# EAGLE design PSPS_AVNC_SRD_central-2020-09-19 (EAGLE 9.6.2)
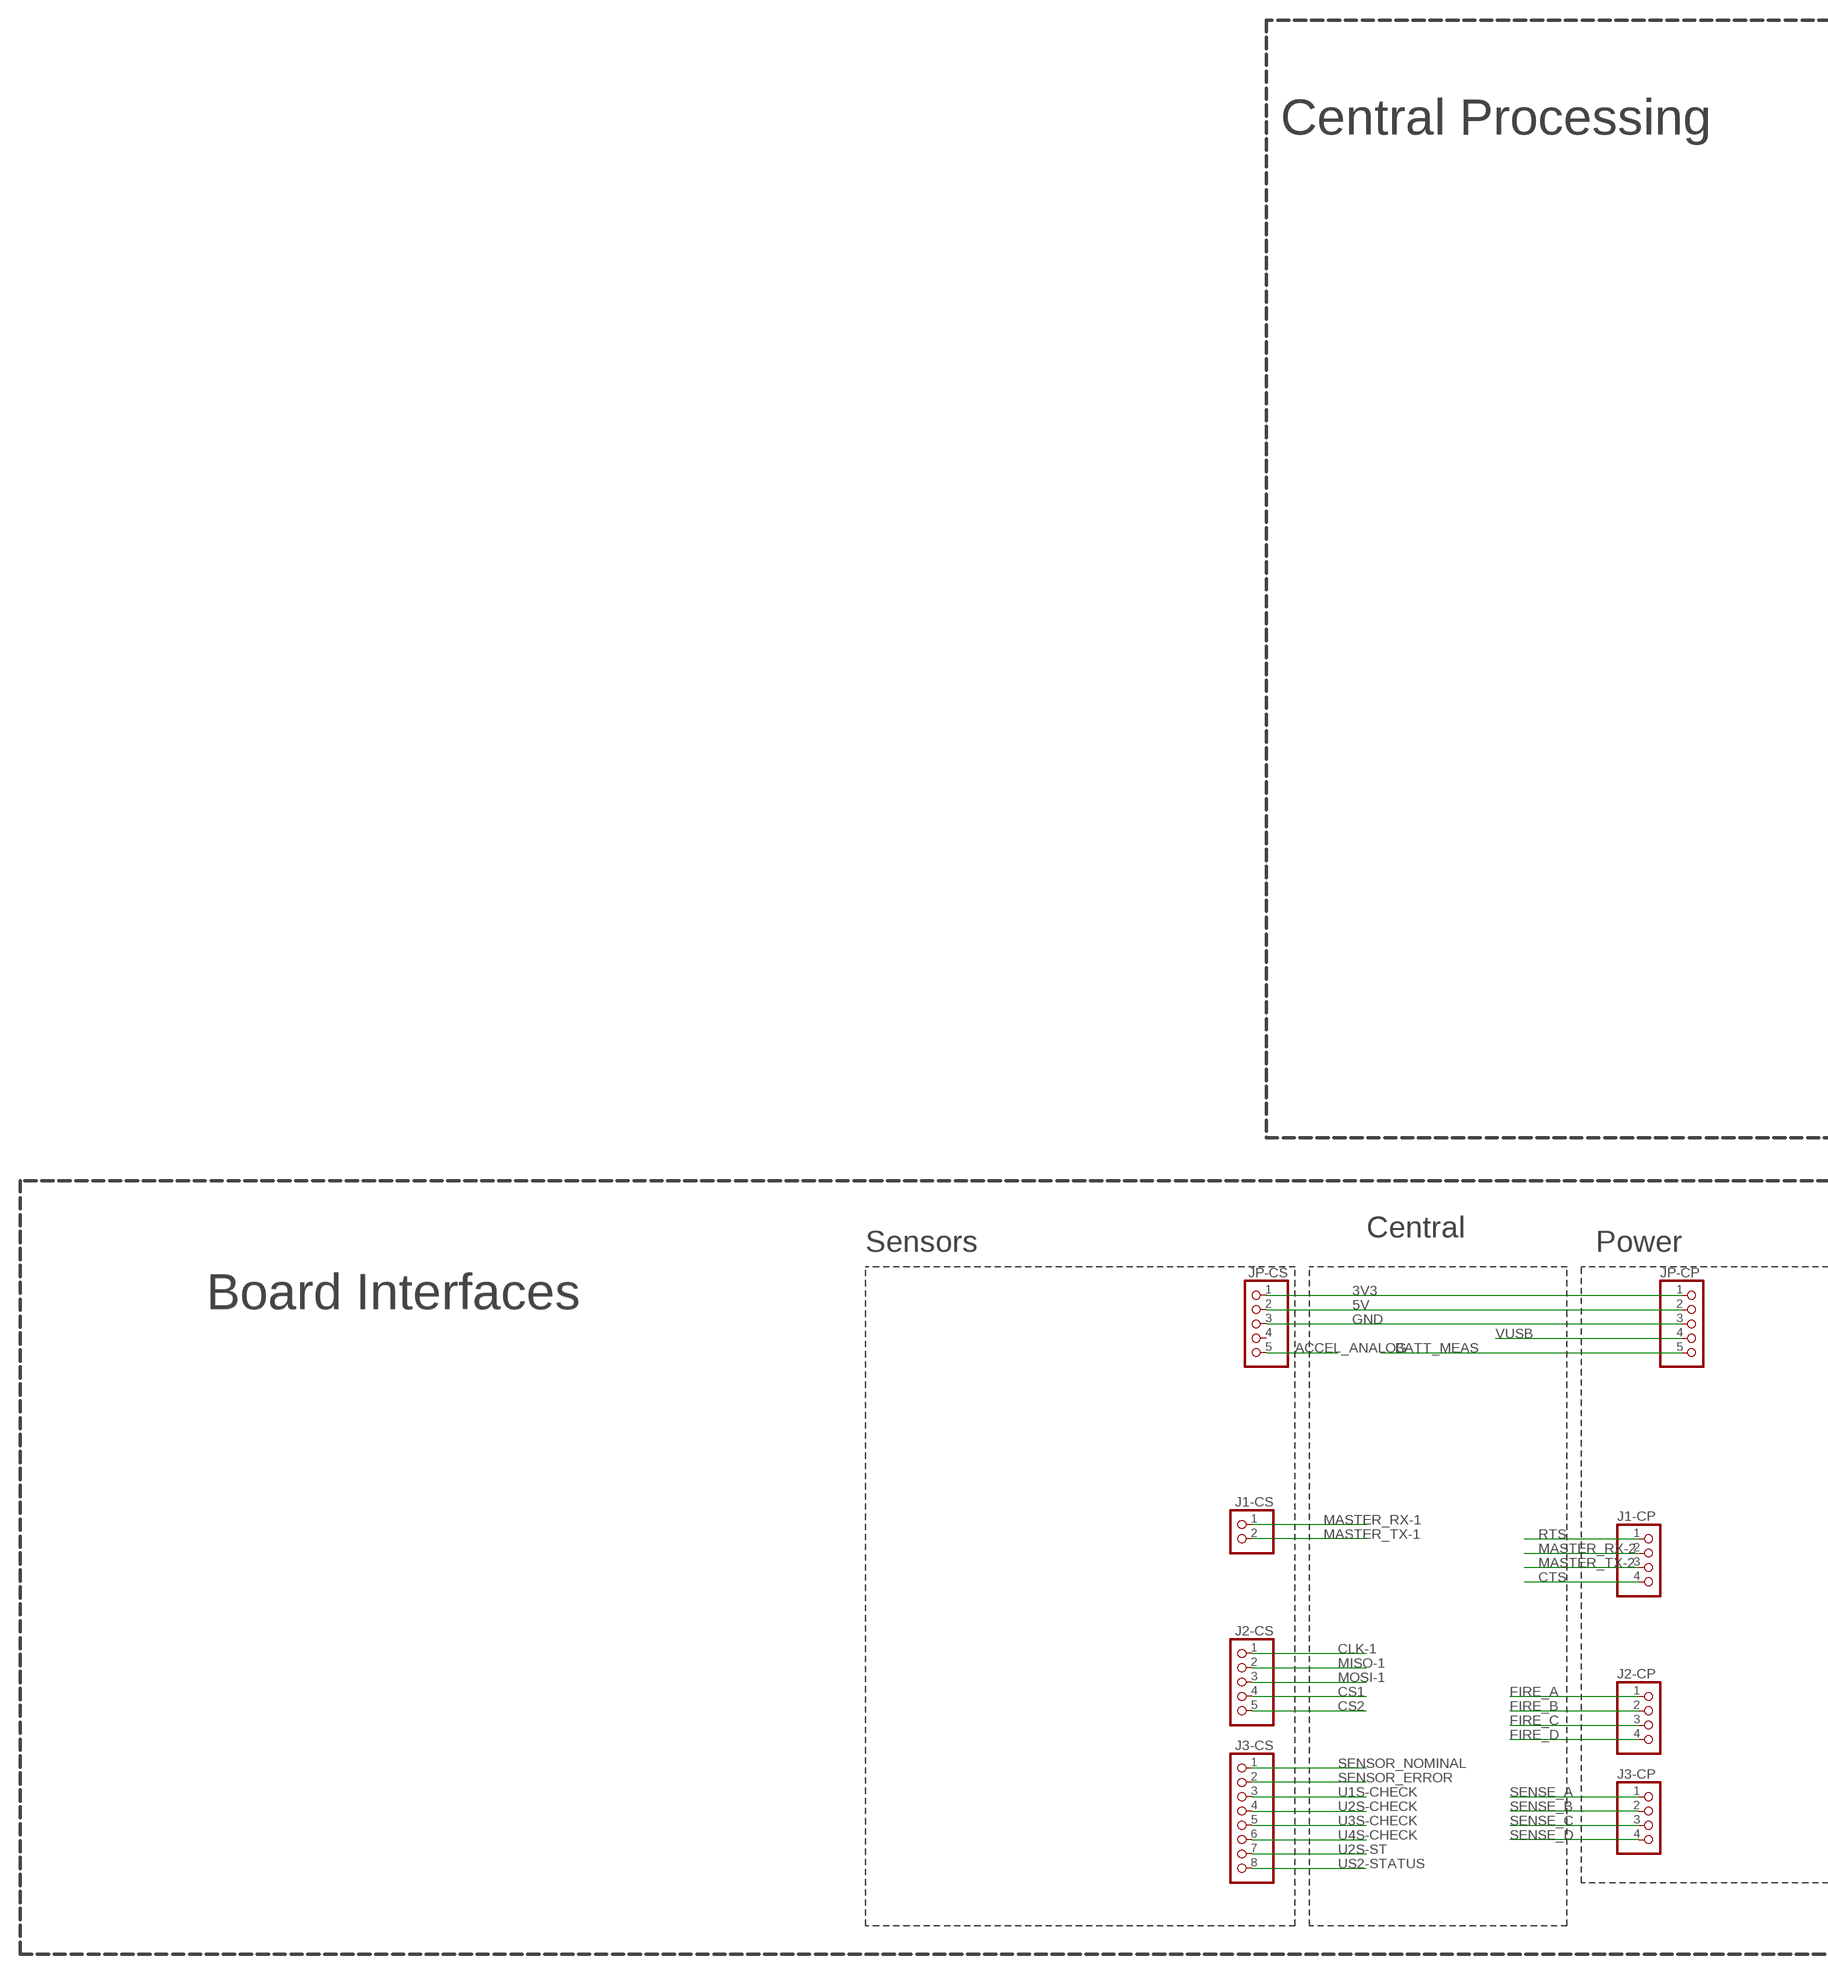
[diagram p0: schematic, sheet 1, part 1 of 2]
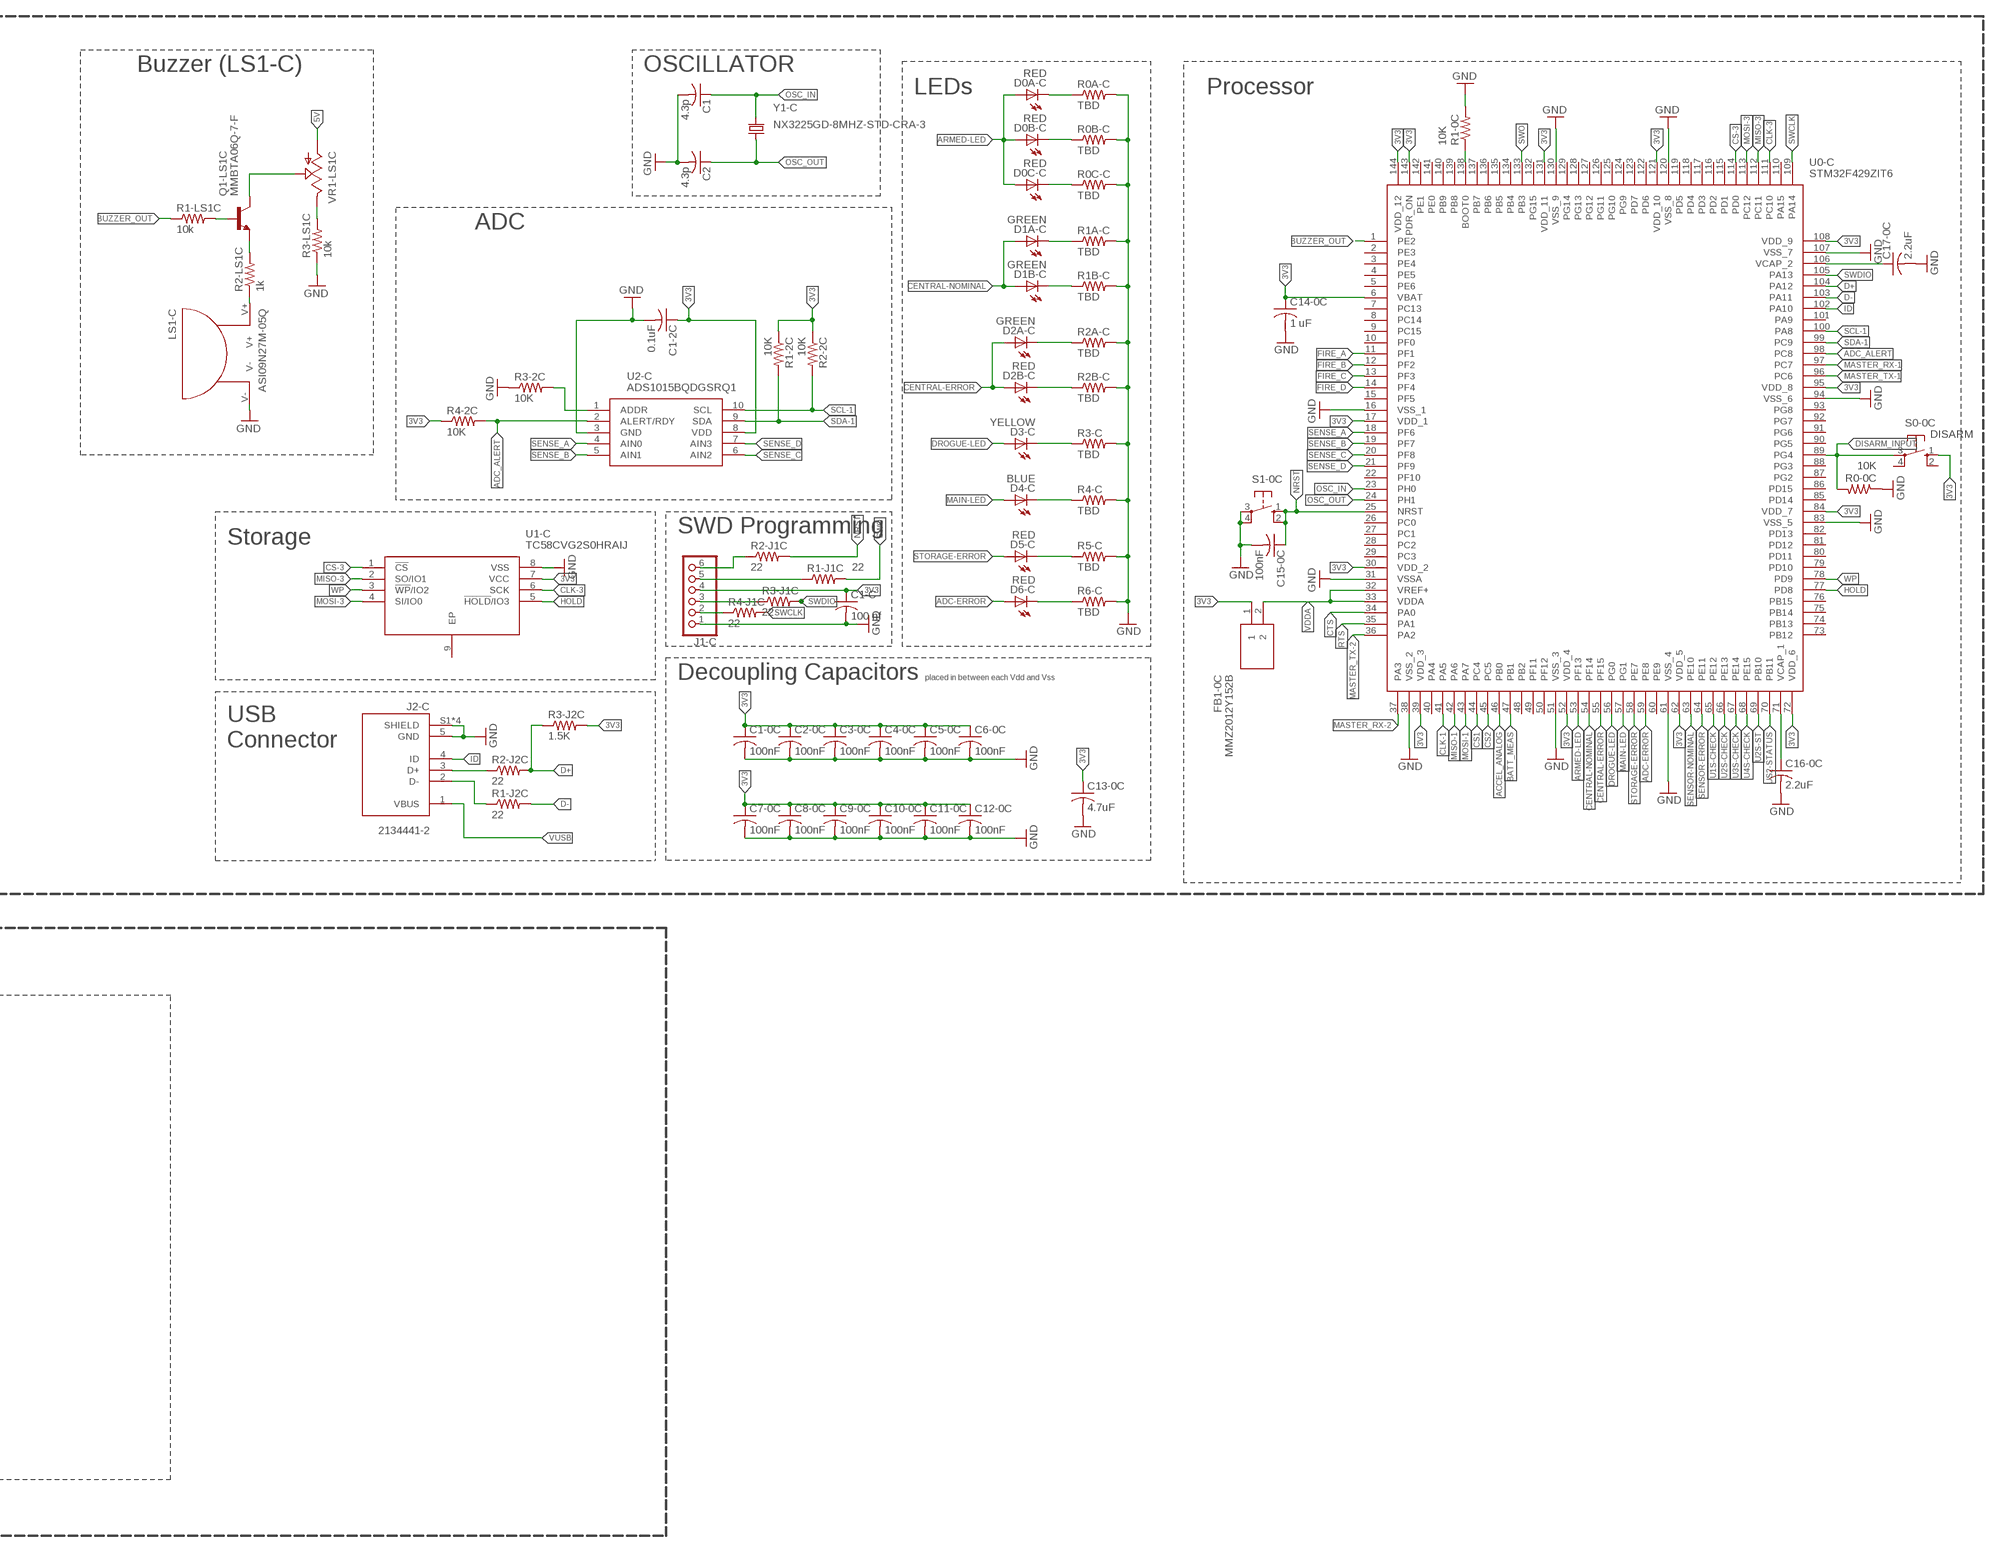
[diagram p1: schematic, sheet 1, part 2 of 2]

## Parts
C1  4.3p  C-USC0805  [C0805]
C1-0C  100nF  C-USC0805  [C0805]
C1-2C  0.1uF  C-USC0805  [C0805]
C1-C  100 nf  C-USC0805  [C0805]
C2  4.3p  C-USC0805  [C0805]
C2-0C  100nF  C-USC0805  [C0805]
C3-0C  100nF  C-USC0805  [C0805]
C4-0C  100nF  C-USC0805  [C0805]
C5-0C  100nF  C-USC0805  [C0805]
C6-0C  100nF  C-USC0805  [C0805]
C7-0C  100nF  C-USC0805  [C0805]
C8-0C  100nF  C-USC0805  [C0805]
C9-0C  100nF  C-USC0805  [C0805]
C10-0C  100nF  C-USC0805  [C0805]
C11-0C  100nF  C-USC0805  [C0805]
C12-0C  100nF  C-USC0805  [C0805]
C13-0C  4.7uF  C-USC0805  [C0805]
C14-0C  1 uF  C-USC0805  [C0805]
C15-0C  100nF  C-USC0805  [C0805]
C16-0C  2.2uF  C-USC0805  [C0805]
C17-0C  2.2uF  C-USC0805  [C0805]
D0A-C  RED  LEDCHIPLED_0805  [CHIPLED_0805]
D0B-C  RED  LEDCHIPLED_0805  [CHIPLED_0805]
D0C-C  RED  LEDCHIPLED_0805  [CHIPLED_0805]
D1A-C  GREEN  LEDCHIPLED_0805  [CHIPLED_0805]
D1B-C  GREEN  LEDCHIPLED_0805  [CHIPLED_0805]
D2A-C  GREEN  LEDCHIPLED_0805  [CHIPLED_0805]
D2B-C  RED  LEDCHIPLED_0805  [CHIPLED_0805]
D3-C  YELLOW  LEDCHIPLED_0805  [CHIPLED_0805]
D4-C  BLUE  LEDCHIPLED_0805  [CHIPLED_0805]
D5-C  RED  LEDCHIPLED_0805  [CHIPLED_0805]
D6-C  RED  LEDCHIPLED_0805  [CHIPLED_0805]
FB1-0C  MMZ2012Y152B  [BEADC2012X105N]
J1-C  PINHD-1X6  [1X06]
J1-CP  PINHD-1X4  [1X04]
J1-CS  PINHD-1X2  [1X02]
J2-C  2134441-2  [TE_2134441-2]
J2-CP  PINHD-1X4  [1X04]
J2-CS  PINHD-1X5  [1X05]
J3-CP  PINHD-1X4  [1X04]
J3-CS  PINHD-1X8  [1X08]
JP-CP  PINHD-1X5  [1X05]
JP-CS  PINHD-1X5  [1X05]
LS1-C  ASI09N27M-05Q  [ASI09N27M-05Q]
Q1-LS1C  MMBTA06Q-7-F  NPN_TRANSISTOR  [SOT23]
R0-0C  10K  R-US_R0805  [R0805]
R0A-C  TBD  R-US_M0805  [M0805]
R0B-C  TBD  R-US_M0805  [M0805]
R0C-C  TBD  R-US_M0805  [M0805]
R1-0C  10K  R-US_R0805  [R0805]
R1-2C  10K  R-US_R0805  [R0805]
R1-J1C  22  R-US_M0805  [M0805]
R1-J2C  22  R-US_M0805  [M0805]
R1-LS1C  10k  R-US_R0805  [R0805]
R1A-C  TBD  R-US_M0805  [M0805]
R1B-C  TBD  R-US_M0805  [M0805]
R2-2C  10K  R-US_R0805  [R0805]
R2-J1C  22  R-US_M0805  [M0805]
R2-J2C  22  R-US_M0805  [M0805]
R2-LS1C  1k  R-US_R0805  [R0805]
R2A-C  TBD  R-US_M0805  [M0805]
R2B-C  TBD  R-US_M0805  [M0805]
R3-2C  10K  R-US_R0805  [R0805]
R3-C  TBD  R-US_M0805  [M0805]
R3-J1C  22  R-US_M0805  [M0805]
R3-J2C  1.5K  R-US_M0805  [M0805]
R3-LS1C  10k  R-US_R0805  [R0805]
R4-2C  10K  R-US_R0805  [R0805]
R4-C  TBD  R-US_M0805  [M0805]
R4-J1C  22  R-US_M0805  [M0805]
R5-C  TBD  R-US_M0805  [M0805]
R6-C  TBD  R-US_M0805  [M0805]
S0-0C  DISARM  10-XX  [B3F-10XX]
S1-0C  10-XX  [B3F-10XX]
U0-C  STM32F429ZIT6  [QFP50P2200X2200X160-144N]
U1-C  TC58CVG2S0HRAIJ  [SON127P800X600X80-9N]
U2-C  ADS1015BQDGSRQ1  [SOP50P490X110-10N]
VR1-LS1C  TRIM_US-LI10  [LI10]
Y1-C  NX3225GD-8MHZ-STD-CRA-3  KX-7  [3.2X2.5_KX-7]

## Nets
3V3: C1-0C.1 C1-2C.1 C1-C.1 C2-0C.1 C3-0C.1 C4-0C.1 C5-0C.1 C6-0C.1 C7-0C.1 C8-0C.1 C9-0C.1 C10-0C.1 C11-0C.1 C12-0C.1 C13-0C.1 C14-0C.1 FB1-0C.1 J1-C.4 JP-CP.1 JP-CS.1 R1-2C.1 R2-2C.1 R3-J2C.2 R4-2C.1 S0-0C.1(S) U0-C.6(VBAT) U0-C.17(VDD_1) U0-C.30(VDD_2) U0-C.39(VDD_3) U0-C.52(VDD_4) U0-C.62(VDD_5) U0-C.72(VDD_6) U0-C.84(VDD_7) U0-C.95(VDD_8) U0-C.108(VDD_9) U0-C.121(VDD_10) U0-C.131(VDD_11) U0-C.143(PDR_ON) U0-C.144(VDD_12) U1-C.7(VCC) U2-C.8(VDD)
5V: JP-CP.2 JP-CS.2 VR1-LS1C.A
ACCEL_ANALOG: JP-CS.5 U0-C.46(PB0)
ADC-ERROR: D6-C.A U0-C.59(PE8)
ADC_ALERT: R4-2C.2 U0-C.98(PC8) U2-C.2(ALERT/RDY)
ADDR: R3-2C.2 U2-C.1(ADDR)
ARMED-LED: D0A-C.A D0B-C.A D0C-C.A U0-C.53(PF13)
BATT_MEAS: JP-CP.5 U0-C.47(PB1)
BOOT0: R1-0C.1 U0-C.138(BOOT0)
BUZZER_OUT: R1-LS1C.1 U0-C.1(PE2)
CENTRAL-ERROR: D2A-C.A D2B-C.A U0-C.55(PF15)
CENTRAL-NOMINAL: D1A-C.A D1B-C.A U0-C.54(PF14)
CLK-1: J2-CS.1 U0-C.41(PA5)
CLK-3: U0-C.111(PC10) U1-C.6(SCK)
CS1: J2-CS.4 U0-C.44(PC4)
CS2: J2-CS.5 U0-C.45(PC5)
CS-3: U0-C.114(PD0) U1-C.1(!CS)
CTS: J1-CP.4 U0-C.34(PA0)
D0A-C_R0A-C: D0A-C.C R0A-C.1
D0B-C_R0B-C: D0B-C.C R0B-C.1
D0C-C_R0C-C: D0C-C.C R0C-C.1
D1A-C_R1A-C: D1A-C.C R1A-C.1
D1B-C_R1B-C: D1B-C.C R1B-C.1
D2A-C_R2A-C: D2A-C.C R2A-C.1
D2B-C_R2B-C: D2B-C.C R2B-C.1
D3-C_R3-C: D3-C.C R3-C.1
D4-C_R4-C: D4-C.C R4-C.1
D5-C_R5-C: D5-C.C R5-C.1
D6-C_R6-C: D6-C.C R6-C.1
D+: R2-J2C.2 R3-J2C.1 U0-C.104(PA12)
D+_R2-J1C: J2-C.3(D+) R2-J2C.1
D-: R1-J2C.2 U0-C.103(PA11)
D-_R1-J1C: J2-C.2(D-) R1-J2C.1
DISARM_INPUT: R0-0C.2 S0-0C.3(P) U0-C.89(PG4)
DROGUE-LED: D3-C.A U0-C.56(PG0)
FIRE_A: J2-CP.1 U0-C.11(PF1)
FIRE_B: J2-CP.2 U0-C.12(PF2)
FIRE_C: J2-CP.3 U0-C.13(PF3)
FIRE_D: J2-CP.4 U0-C.14(PF4)
GND: C1-0C.2 C1-2C.2 C1-C.2 C1.2 C2-0C.2 C2.2 C3-0C.2 C4-0C.2 C5-0C.2 C6-0C.2 C7-0C.2 C8-0C.2 C9-0C.2 C10-0C.2 C11-0C.2 C12-0C.2 C13-0C.2 C14-0C.2 C15-0C.2 C16-0C.2 C17-0C.2 J1-C.1 J2-C.5(GND) J2-C.S1(SHIELD) J2-C.S2(SHIELD) J2-C.S3(SHIELD) J2-C.S4(SHIELD) JP-CP.3 JP-CS.3 LS1-C.V- R0-0C.1 R0A-C.2 R0B-C.2 R0C-C.2 R1-0C.2 R1A-C.2 R1B-C.2 R2A-C.2 R2B-C.2 R3-2C.1 R3-C.2 R3-LS1C.1 R4-C.2 R5-C.2 R6-C.2 S1-0C.3(P) S1-0C.4(P1) U0-C.16(VSS_1) U0-C.31(VSSA) U0-C.38(VSS_2) U0-C.51(VSS_3) U0-C.61(VSS_4) U0-C.83(VSS_5) U0-C.94(VSS_6) U0-C.107(VSS_7) U0-C.120(VSS_8) U0-C.130(VSS_9) U1-C.8(VSS) U2-C.3(GND)
HOLD: U0-C.77(PD8) U1-C.5(!HOLD!/IO3)
ID: J2-C.4(ID) U0-C.102(PA10)
J1-C_R1-J1C: J1-C.5 R1-J1C.1
J1-C_R2-J1C: J1-C.6 R2-J1C.1
MAIN-LED: D4-C.A U0-C.57(PG1)
MASTER_RX-1: J1-CS.1 U0-C.97(PC7)
MASTER_RX-2: J1-CP.2 U0-C.37(PA3)
MASTER_TX-1: J1-CS.2 U0-C.96(PC6)
MASTER_TX-2: J1-CP.3 U0-C.36(PA2)
MISO-1: J2-CS.2 U0-C.42(PA6)
MISO-3: U0-C.112(PC11) U1-C.2(SO/IO1)
MOSI-1: J2-CS.3 U0-C.43(PA7)
MOSI-3: U0-C.113(PC12) U1-C.4(SI/IO0)
NRST: C15-0C.1 R2-J1C.2 S1-0C.1(S) S1-0C.2(S1) U0-C.25(NRST)
OSC_IN: C1.1 U0-C.23(PH0) Y1-C.3
OSC_OUT: C2.1 U0-C.24(PH1) Y1-C.1
Q1-LS1C_R2-LS1C: Q1-LS1C.3(E) R2-LS1C.2
R1-LS1C_Q1-LS1C: Q1-LS1C.1(B) R1-LS1C.2
R2-LS1C_LS1-C: LS1-C.V+ R2-LS1C.1
RTS: J1-CP.1 U0-C.35(PA1)
SCL-1: R2-2C.2 U0-C.100(PA8) U2-C.10(SCL)
SDA-1: R1-2C.2 U0-C.99(PC9) U2-C.9(SDA)
SENSE_A: J3-CP.1 U0-C.18(PF6) U2-C.4(AIN0)
SENSE_B: J3-CP.2 U0-C.19(PF7) U2-C.5(AIN1)
SENSE_C: J3-CP.3 U0-C.20(PF8) U2-C.6(AIN2)
SENSE_D: J3-CP.4 U0-C.21(PF9) U2-C.7(AIN3)
SENSOR-ERROR: U0-C.64(PE11)
SENSOR-NOMINAL: U0-C.63(PE10)
SENSOR_ERROR: J3-CS.2
SENSOR_NOMINAL: J3-CS.1
STORAGE-ERROR: D5-C.A U0-C.58(PE7)
SWCLK: J1-C.2 R4-J1C.1 R4-J1C.2 U0-C.109(PA14)
SWDIO: J1-C.3 R3-J1C.1 R3-J1C.2 U0-C.105(PA13)
SWO: R1-J1C.2 U0-C.133(PB3)
U1S-CHECK: J3-CS.3 U0-C.65(PE12)
U2S-CHECK: J3-CS.4 U0-C.66(PE13)
U2S-ST: J3-CS.7 U0-C.69(PB10)
U3S-CHECK: J3-CS.5 U0-C.67(PE14)
U4S-CHECK: J3-CS.6 U0-C.68(PE15)
US2-STATUS: J3-CS.8 U0-C.70(PB11)
VCAP_1: C16-0C.1 U0-C.71(VCAP_1)
VCAP_2: C17-0C.1 U0-C.106(VCAP_2)
VDDA: FB1-0C.2 U0-C.32(VREF+) U0-C.33(VDDA)
VR1-LS1C: Q1-LS1C.2(C) VR1-LS1C.S
VR1-LS1C_R3-LS1C: R3-LS1C.2 VR1-LS1C.E
VUSB: J2-C.1(VBUS) JP-CP.4
WP: U0-C.78(PD9) U1-C.3(!WP!/IO2)
Unconnected: JP-CS.4 S0-0C.2(S1) S0-0C.4(P1) U0-C.2(PE3) U0-C.3(PE4) U0-C.4(PE5) U0-C.5(PE6) U0-C.7(PC13) U0-C.8(PC14) U0-C.9(PC15) U0-C.10(PF0) U0-C.15(PF5) U0-C.22(PF10) U0-C.26(PC0) U0-C.27(PC1) U0-C.28(PC2) U0-C.29(PC3) U0-C.40(PA4) U0-C.48(PB2) U0-C.49(PF11) U0-C.50(PF12) U0-C.60(PE9) U0-C.73(PB12) U0-C.74(PB13) U0-C.75(PB14) U0-C.76(PB15) U0-C.79(PD10) U0-C.80(PD11) U0-C.81(PD12) U0-C.82(PD13) U0-C.85(PD14) U0-C.86(PD15) U0-C.87(PG2) U0-C.88(PG3) U0-C.90(PG5) U0-C.91(PG6) U0-C.92(PG7) U0-C.93(PG8) U0-C.101(PA9) U0-C.110(PA15) U0-C.115(PD1) U0-C.116(PD2) U0-C.117(PD3) U0-C.118(PD4) U0-C.119(PD5) U0-C.122(PD6) U0-C.123(PD7) U0-C.124(PG9) U0-C.125(PG10) U0-C.126(PG11) U0-C.127(PG12) U0-C.128(PG13) U0-C.129(PG14) U0-C.132(PG15) U0-C.134(PB4) U0-C.135(PB5) U0-C.136(PB6) U0-C.137(PB7) U0-C.139(PB8) U0-C.140(PB9) U0-C.141(PE0) U0-C.142(PE1) U1-C.9(EP)

## Notes on the sheet
- Buzzer (LS1-C) | OSCILLATOR
- LEDs | Processor
- Central Processing
- ADC
- SWD Programming
- Storage
- Decoupling Capacitors | placed in between each Vdd and Vss
- USB 
  Connector
- Central
- Sensors | Power
- Board Interfaces

## Library data of the parts
C1 C1-0C C1-2C C1-C C2 C2-0C C3-0C C4-0C C5-0C C6-0C C7-0C C8-0C C9-0C C10-0C C11-0C C12-0C C13-0C C14-0C C15-0C C16-0C C17-0C = rcl:C-US: CAPACITOR, American symbol; SPICEPREFIX: C
D0A-C D0B-C D0C-C D1A-C D1B-C D2A-C D2B-C D3-C D4-C D5-C D6-C = adafruit:LED: LED OSRAM: - CHIPLED LG R971, LG N971, LY N971, LG Q971, LY Q971, LO R971, LY R971 LH N974, LH R974 LS Q976, LO Q976, LY Q976 LO Q996 - Hyper CHIPLED LW Q18S LB Q993, LB Q99A, LB R99A - SideLED LS A670, LO A670, LY A670, LG A670, LP A670 LB A673, LV A673, LT A673, LW A673 LH A674 LY A675 LS A676, LA A676, LO A676, LY A676, LW A676 LS A679, LY A679, LG A679 - Hyper Micro SIDELED® LS Y876, LA Y876, LO Y876, LY Y876 LT Y87S - SmartLED LW L88C, LW L88S LB L89C, LB L89S, LG L890 LS L89K, LO L89K, LY L89K LS L896, LA L896, LO L896, LY L896 - TOPLED LS T670, LO T670, LY T670, LG T670, LP T670 LSG T670, LSP T670, LSY T670, LOP T670, LYG T670 LG T671, LOG T671, LSG T671 LB T673, LV T673, LT T673, LW T673 LH T674 LS T676, LA T676, LO T676, LY T676, LB T676, LH T676, LSB T676, LW T676 LB T67C, LV T67C, LT T67C, LS T67K, LO T67K, LY T67K, LW E67C LS E67B, LA E67B, LO E67B, LY E67B, LB E67C, LV E67C, LT E67C LW T67C LS T679, LY T679, LG T679 LS T770, LO T770, LY T770, LG T770, LP T770 LB T773, LV T773, LT T773, LW T773 LH T774 LS E675, LA E675, LY E675, LS T675 LS T776, LA T776, LO T776, LY T776, LB T776 LHGB T686 LT T68C, LB T68C - Hyper Mini TOPLED® LB M676 - Mini TOPLED Santana® LG M470 LS M47K, LO M47K, LY M47K Source: http://www.osram.convergy.de/
FB1-0C = SamacSys_Parts:MMZ2012Y152B: Ferrite bead SMD 1500Ohm 500mA TDK Ferrite Bead (Chip Bead), 2 x 1.25 x 0.85mm (0805) Source: Datasheet; DESCRIPTION: Ferrite bead SMD 1500Ohm 500mA TDK Ferrite Bead (Chip Bead), 2 x 1.25 x 0.85mm (0805); HEIGHT: 1.05mm; MANUFACTURER_NAME: TDK; MANUFACTURER_PART_NUMBER: MMZ2012Y152B; MOUSER_PART_NUMBER: 810-MMZ2012Y152B; MOUSER_PRICE-STOCK: https://www.mouser.com/Search/Refine.aspx?Keyword=810-MMZ2012Y152B
J1-C = pinhead:PINHD-1X6: PIN HEADER
J1-CP J2-CP J3-CP = pinhead:PINHD-1X4: PIN HEADER
J1-CS = pinhead:PINHD-1X2: PIN HEADER
J2-C = 2134441-2:2134441-2: Conn Micro USB RCP 5 POS 0.65mm Solder RA SMD 5 Terminal 1 Port T/R; COMMENT: 2134441-2; DESCRIPTION: Conn Micro USB RCP 5 POS 0.65mm Solder RA SMD 5 Terminal 1 Port T/R; DIGI-KEY_PART_NUMBER: A118104CT-ND; DIGI-KEY_PURCHASE_URL: https://www.digikey.com/product-detail/en/te-connectivity-amp-connectors/2134441-2/A118104CT-ND/4729911?utm_source=snapeda&utm_medium=aggregator&utm_campaign=symbol; MF: TE Connectivity; MP: 2134441-2; PACKAGE: None; TE_PURCHASE_URL: https://www.te.com/usa-en/product-2134441-2.html?te_bu=Cor&te_type=disp&te_campaign=seda_glo_cor-seda-global-disp-prtnr-fy19-seda-model-bom-cta_sma-317_1&elqCampaignId=32493
J2-CS JP-CP JP-CS = pinhead:PINHD-1X5: PIN HEADER
J3-CS = pinhead:PINHD-1X8: PIN HEADER
LS1-C = Computer2:ASI09N27M-05Q
Q1-LS1C = Flight Computer Parts:NPN_TRANSISTOR
R0-0C R0A-C R0B-C R0C-C R1-0C R1-2C R1-J1C R1-J2C R1A-C R1B-C R2-2C R2-J1C R2-J2C R2A-C R2B-C R3-2C R3-C R3-J1C R3-J2C R4-2C R4-C R4-J1C R5-C R6-C = rcl:R-US_: RESISTOR, American symbol; SPICEPREFIX: R
R1-LS1C R2-LS1C R3-LS1C = resistor:R-US_: RESISTOR, American symbol
S0-0C S1-0C = switch-omron:10-XX: OMRON SWITCH; MPN: B3F-1000; OC_FARNELL: 176432; OC_NEWARK: 36M3542
U0-C = SamacSys_Parts:STM32F429ZIT6: 32-Bit MCU+FPU M4 2MB LCD-TFT LQFP144 STMicroelectronics STM32F429ZIT6, 32bit ARM Cortex M4 MCU, 180MHz, 2048 kB Flash, 144-Pin LQFP Source: Datasheet; DESCRIPTION: 32-Bit MCU+FPU M4 2MB LCD-TFT LQFP144 STMicroelectronics STM32F429ZIT6, 32bit ARM Cortex M4 MCU, 180MHz, 2048 kB Flash, 144-Pin LQFP; HEIGHT: 1.6mm; MANUFACTURER_NAME: STMicroelectronics; MANUFACTURER_PART_NUMBER: STM32F429ZIT6; MOUSER_PART_NUMBER: 511-STM32F429ZIT6; MOUSER_PRICE-STOCK: https://www.mouser.com/Search/Refine.aspx?Keyword=511-STM32F429ZIT6
U1-C = SamacSys_Parts:TC58CVG2S0HRAIJ: NAND Flash 4G-bit 128M X 8bit Serial 8-Pin WSON Source: Datasheet; DESCRIPTION: NAND Flash 4G-bit 128M X 8bit Serial 8-Pin WSON; HEIGHT: 0.8mm; MANUFACTURER_NAME: Kioxia America; MANUFACTURER_PART_NUMBER: TC58CVG2S0HRAIJ; MOUSER_PART_NUMBER: 757-TC58CVG2S0HRAIJ; MOUSER_PRICE-STOCK: https://www.mouser.co.uk/ProductDetail/Kioxia-America/TC58CVG2S0HRAIJ?qs=OlC7AqGiEDkQEWU%2FaAG3Ug%3D%3D
U2-C = SamacSys_Parts:ADS1015BQDGSRQ1: Automotive 12-Bit 3.3kSPS 4-Ch Delta-Sigma ADC With PGA, Oscillator, VREF, Comparator, and I2C Source: Datasheet; DESCRIPTION: Automotive 12-Bit 3.3kSPS 4-Ch Delta-Sigma ADC With PGA, Oscillator, VREF, Comparator, and I2C; HEIGHT: 1.1mm; MANUFACTURER_NAME: Texas Instruments; MANUFACTURER_PART_NUMBER: ADS1015BQDGSRQ1; MOUSER_PART_NUMBER: 595-ADS1015BQDGSRQ1; MOUSER_PRICE-STOCK: https://www.mouser.com/Search/Refine.aspx?Keyword=595-ADS1015BQDGSRQ1
VR1-LS1C = pot:TRIM_US-: POTENTIOMETER
Y1-C = crystal-geyer_V1_0:KX: Quartz Crystals (MHz) SMD: KX - Serie Model Size l/w/h [mm] Frequency Range Frequency Stability Temp. Range [°C] Load Capacitance AECQ 200 availabel Datasheet KX-4 KX-5 KX-6 KX-7 KX-9A KX-9B KX-12A KX-12B KX-13 KX-20 KX-K KX-KS 1.6/1.2/0.3 2.0/1.6/0.45 2.5/2.0/0.55 3.2/2.5/0.8 5.0/3.2/1.0 5.0/3.2/1.1 6.0/3.5/1.1 6.0/3.5/1.0 7.0/5.0 /1.3 11.6/5.5/1.6 12.3/4.5/4.2 12.3/4.5/3.2 24.0 ~ 80.0 MHz 16.0 ~ 80.0 MHz 12.0 ~ 80.0 MHz 8.0 ~ 60.0 MHz 7,68 ~ 300,0 MHz 8,0 ~ 50,0 MHz 8,0 ~ 150,0 MHz 8,0 ~ 50,0 MHz 6,0 ~ 160,0 MHz 3,579 ~ 25,0 MHz 3,579 ~ 70,0 MHz 3,579 ~ 70,0 MHz ±10 … ±50ppm ±10 … ±50ppm ±10 … ±50ppm ±10 … ±50ppm ±10 … ±50ppm ±10 … ±50ppm ±10 … ±50ppm ±10 … ±50ppm ±10 … ±50ppm ±50ppm ±10 … ±50ppm ±10 … ±50ppm (*) -40°C …+85°C (*) -40°C …+125°C (*) -40°C …+125°C (*) -40°C …+125°C (*) -40°C …+105°C (*) -40°C …+105°C (*) -40°C …+125°C (*) -40°C …+105°C (*) -40°C …+105°C (*) -40°C …+105°C (*) -40°C …+85°C (*) -40°C …+85°C 8, 8…16 8, 8…16 10, 8…16 12, 7…20 16, 10…20 16, 10…20 16, 10…20 16, 12…20 16, 12…20 16, 12…20 16, 12…30 16, 12…30 - yes yes yes - - - - - - - - KX-4.pdf KX-5.pdf KX-6.pdf KX-7.pdf KX-9A.pdf KX-9B.pdf KX-12A.pdf KX-12B.pdf KX-13.pdf KX-20.pdf KX-K.pdf KX-KS.pdf Details see: http://www.geyer-electronic.de/Frequenz-Produkte.9.0.html Created 2016-06-07, Hans Locher 2016 (C) Geyer Quartz Technology KX4,KX5,KX6,KX7,KX9A,KX9B,KX12A,KX12B,KX13,KX20,KXK,KXKS;1612;2016;2520;3225;5032;6035;7050;11655;12345;1,6x1,2;2,0x1,6;2,5x2,0;3,2x2,5;5,0x3,2;6,0x3,5;7,0x5,0;11,6x5,5;12,3x4,5;12,3x4,5;1.6x1.2;2.0x1.6;2.5x2.0;3.2x2.5;5.0x3.2;6.0x3.5;7.0x5.0;11.6x5.5;12.3x4.5;12.3x4.5;

## Board
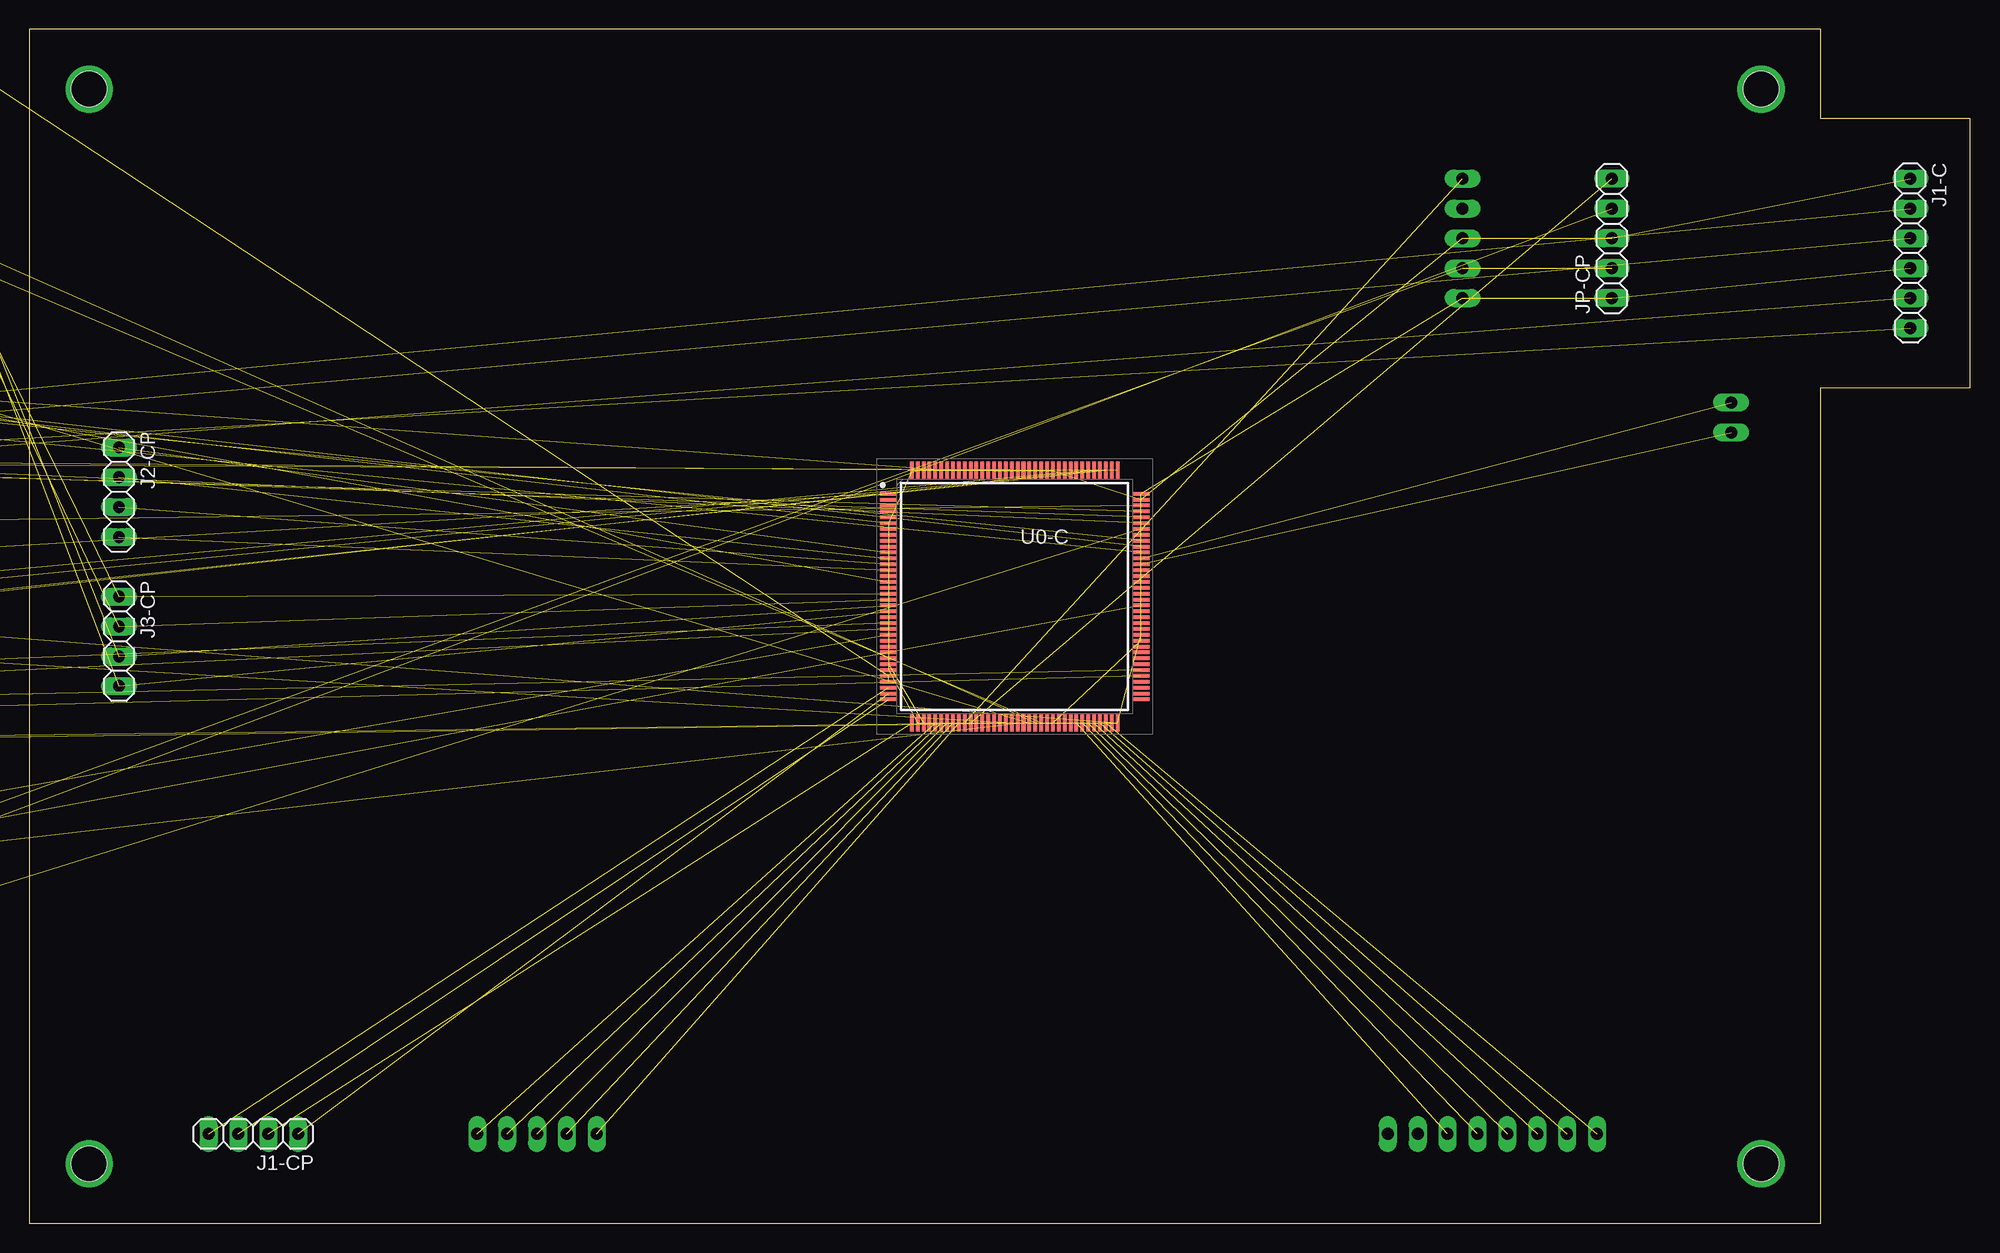
[diagram p2: board, top side]
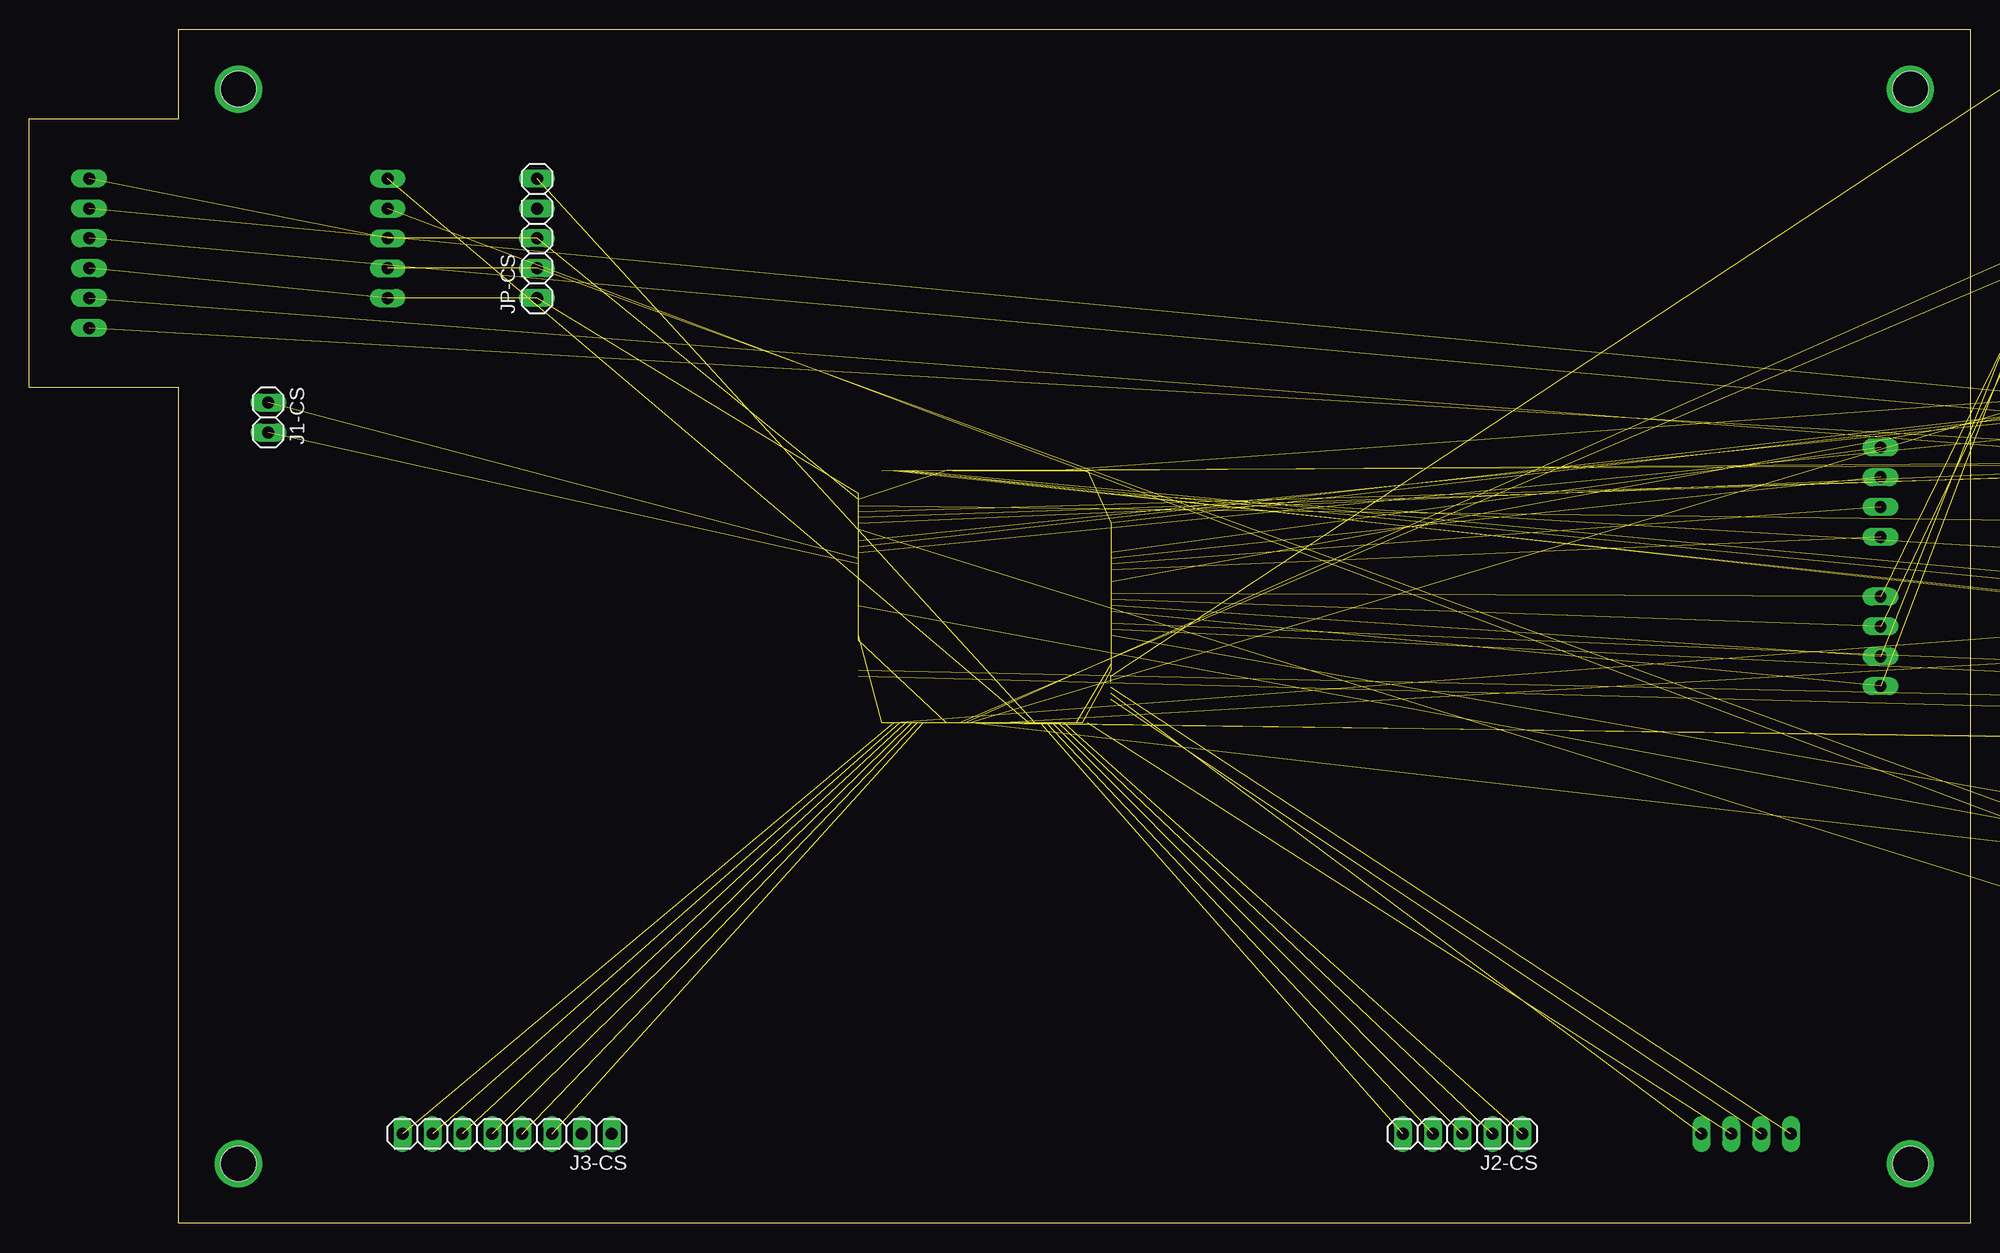
[diagram p3: board, bottom side, seen from below]

Size 165.1 x 101.6 mm. Coordinates in mm from the lower left corner, seen from the top.
Outline: 0,0 152.4,0 152.4,71.12 165.1,71.12 165.1,93.98 152.4,93.98 152.4,101.6 0,101.6 0,0
Copper layers (1*16): Top 0.035mm / dielectric 1.5mm / Bottom 0.035mm
Design rules "default": minimum track width 6mil, minimum drill 0.35mm, track to track 6mil, track to pad 6mil, pad to pad 6mil, via to via 6mil, smd to smd 6mil, copper to edge 40mil, drill to drill 6mil, minimum pad ring 10mil, minimum via ring 8mil, stop-mask expansion 4mil, vias tented up to drill 0mil, thermal gap 10mil
Holes 3 mm at 5.08,96.52 147.32,96.52 147.32,5.08 5.08,5.08

### Footprints (pad centres in the part's own frame; a part is rotated, then mirrored left to right if it is on the bottom)
C0805 = smd 1.3 x 1.5: 1 -0.95,0; 2 0.95,0
CHIPLED_0805 = smd 1.2 x 1.2: A 0,-1.05; C 0,1.05
BEADC2012X105N = smd 1.2 x 1.45: 1 -0.85,0; 2 0.85,0
1X06 = drill 1.016 long: 1 -6.35,0; 2 -3.81,0; 3 -1.27,0; 4 1.27,0; 5 3.81,0; 6 6.35,0
1X04 = drill 1.016 long: 1 -3.81,0; 2 -1.27,0; 3 1.27,0; 4 3.81,0
1X02 = drill 1.016 long: 1 -1.27,0; 2 1.27,0
TE_2134441-2 = smd 1.4 x 0.4: 1 -4.45,1.3; 2 -4.45,0.65; 3 -4.45,0; 4 -4.45,-0.65; 5 -4.45,-1.3 | drill 0.8 pad 1.25 long: S1 -4,-4.875; S2 0,-4.875; S3 0,4.875; S4 -4,4.875
1X05 = drill 1.016 long: 1 -5.08,0; 2 -2.54,0; 3 0,0; 4 2.54,0; 5 5.08,0
1X08 = drill 1.016 long: 1 -8.89,0; 2 -6.35,0; 3 -3.81,0; 4 -1.27,0; 5 1.27,0; 6 3.81,0; 7 6.35,0; 8 8.89,0
ASI09N27M-05Q = smd 2.184 x 1.067: V+ 3.81,0; V- -3.81,0
SOT23 = smd 1 x 1.4: 1 -0.95,-1.1; 2 0.95,-1.1; 3 0,1.1
R0805 = smd 1.3 x 1.5: 1 -0.95,0; 2 0.95,0
M0805 = smd 1.3 x 1.6: 1 -0.95,0; 2 0.95,0
B3F-10XX = drill 1.016 long: 1 -3.251,2.261; 2 3.251,2.261; 3 -3.251,-2.261; 4 3.251,-2.261
QFP50P2200X2200X160-144N = smd 1.475 x 0.3: 1 -10.738,8.75; 2 -10.738,8.25; 3 -10.738,7.75; 4 -10.738,7.25; 5 -10.738,6.75; 6 -10.738,6.25; 7 -10.738,5.75; 8 -10.738,5.25; 9 -10.738,4.75; 10 -10.738,4.25; 11 -10.738,3.75; 12 -10.738,3.25; 13 -10.738,2.75; 14 -10.738,2.25; 15 -10.738,1.75; 16 -10.738,1.25; 17 -10.738,0.75; 18 -10.738,0.25; 19 -10.738,-0.25; 20 -10.738,-0.75; 21 -10.738,-1.25; 22 -10.738,-1.75; 23 -10.738,-2.25; 24 -10.738,-2.75; 25 -10.738,-3.25; 26 -10.738,-3.75; 27 -10.738,-4.25; 28 -10.738,-4.75; 29 -10.738,-5.25; 30 -10.738,-5.75; 31 -10.738,-6.25; 32 -10.738,-6.75; 33 -10.738,-7.25; 34 -10.738,-7.75; 35 -10.738,-8.25; 36 -10.738,-8.75; 73 10.738,-8.75; 74 10.738,-8.25; 75 10.738,-7.75; 76 10.738,-7.25; 77 10.738,-6.75; 78 10.738,-6.25; 79 10.738,-5.75; 80 10.738,-5.25; 81 10.738,-4.75; 82 10.738,-4.25; 83 10.738,-3.75; 84 10.738,-3.25; 85 10.738,-2.75; 86 10.738,-2.25; 87 10.738,-1.75; 88 10.738,-1.25; 89 10.738,-0.75; 90 10.738,-0.25; 91 10.738,0.25; 92 10.738,0.75; 93 10.738,1.25; 94 10.738,1.75; 95 10.738,2.25; 96 10.738,2.75; 97 10.738,3.25; 98 10.738,3.75; 99 10.738,4.25; 100 10.738,4.75; 101 10.738,5.25; 102 10.738,5.75; 103 10.738,6.25; 104 10.738,6.75; 105 10.738,7.25; 106 10.738,7.75; 107 10.738,8.25; 108 10.738,8.75 | smd 0.3 x 1.475: 37 -8.75,-10.738; 38 -8.25,-10.738; 39 -7.75,-10.738; 40 -7.25,-10.738; 41 -6.75,-10.738; 42 -6.25,-10.738; 43 -5.75,-10.738; 44 -5.25,-10.738; 45 -4.75,-10.738; 46 -4.25,-10.738; 47 -3.75,-10.738; 48 -3.25,-10.738; 49 -2.75,-10.738; 50 -2.25,-10.738; 51 -1.75,-10.738; 52 -1.25,-10.738; 53 -0.75,-10.738; 54 -0.25,-10.738; 55 0.25,-10.738; 56 0.75,-10.738; 57 1.25,-10.738; 58 1.75,-10.738; 59 2.25,-10.738; 60 2.75,-10.738; 61 3.25,-10.738; 62 3.75,-10.738; 63 4.25,-10.738; 64 4.75,-10.738; 65 5.25,-10.738; 66 5.75,-10.738; 67 6.25,-10.738; 68 6.75,-10.738; 69 7.25,-10.738; 70 7.75,-10.738; 71 8.25,-10.738; 72 8.75,-10.738; 109 8.75,10.738; 110 8.25,10.738; 111 7.75,10.738; 112 7.25,10.738; 113 6.75,10.738; 114 6.25,10.738; 115 5.75,10.738; 116 5.25,10.738; 117 4.75,10.738; 118 4.25,10.738; 119 3.75,10.738; 120 3.25,10.738; 121 2.75,10.738; 122 2.25,10.738; 123 1.75,10.738; 124 1.25,10.738; 125 0.75,10.738; 126 0.25,10.738; 127 -0.25,10.738; 128 -0.75,10.738; 129 -1.25,10.738; 130 -1.75,10.738; 131 -2.25,10.738; 132 -2.75,10.738; 133 -3.25,10.738; 134 -3.75,10.738; 135 -4.25,10.738; 136 -4.75,10.738; 137 -5.25,10.738; 138 -5.75,10.738; 139 -6.25,10.738; 140 -6.75,10.738; 141 -7.25,10.738; 142 -7.75,10.738; 143 -8.25,10.738; 144 -8.75,10.738
SON127P800X600X80-9N = smd 0.95 x 0.45: 1 -3.9,1.905; 2 -3.9,0.635; 3 -3.9,-0.635; 4 -3.9,-1.905; 5 3.9,-1.905; 6 3.9,-0.635; 7 3.9,0.635; 8 3.9,1.905 | smd 3.5 x 4.4: 9 0,0
SOP50P490X110-10N = smd 1.4 x 0.3: 1 -2.2,1; 2 -2.2,0.5; 3 -2.2,0; 4 -2.2,-0.5; 5 -2.2,-1; 6 2.2,-1; 7 2.2,-0.5; 8 2.2,0; 9 2.2,0.5; 10 2.2,1
LI10 = drill 1.321 octagon: A -2.54,-5.08; E 2.54,-5.08; S 0,5.08
3.2X2.5_KX-7 = smd 1.3 x 1.1: 1 -1.15,-0.9; 2 1.15,-0.9; 3 1.15,0.9; 4 -1.15,0.9

### Placement (x,y rotation side)
C1  not placed on the board
C1-0C  not placed on the board
C1-2C  not placed on the board
C1-C  not placed on the board
C2  not placed on the board
C2-0C  not placed on the board
C3-0C  not placed on the board
C4-0C  not placed on the board
C5-0C  not placed on the board
C6-0C  not placed on the board
C7-0C  not placed on the board
C8-0C  not placed on the board
C9-0C  not placed on the board
C10-0C  not placed on the board
C11-0C  not placed on the board
C12-0C  not placed on the board
C13-0C  not placed on the board
C14-0C  not placed on the board
C15-0C  not placed on the board
C16-0C  not placed on the board
C17-0C  not placed on the board
D0A-C  not placed on the board
D0B-C  not placed on the board
D0C-C  not placed on the board
D1A-C  not placed on the board
D1B-C  not placed on the board
D2A-C  not placed on the board
D2B-C  not placed on the board
D3-C  not placed on the board
D4-C  not placed on the board
D5-C  not placed on the board
D6-C  not placed on the board
FB1-0C  not placed on the board
J1-C  160.02,82.55 270 top
J1-CP  19.05,7.62 180 top
J1-CS  144.78,68.58 270 bottom
J2-C  not placed on the board
J2-CP  7.62,62.23 270 top
J2-CS  43.18,7.62 180 bottom
J3-CP  7.62,49.53 270 top
J3-CS  124.46,7.62 180 bottom
JP-CP  134.62,83.82 90 top
JP-CS  121.92,83.82 90 bottom
LS1-C  not placed on the board
Q1-LS1C  not placed on the board
R0-0C  not placed on the board
R0A-C  not placed on the board
R0B-C  not placed on the board
R0C-C  not placed on the board
R1-0C  not placed on the board
R1-2C  not placed on the board
R1-J1C  not placed on the board
R1-J2C  not placed on the board
R1-LS1C  not placed on the board
R1A-C  not placed on the board
R1B-C  not placed on the board
R2-2C  not placed on the board
R2-J1C  not placed on the board
R2-J2C  not placed on the board
R2-LS1C  not placed on the board
R2A-C  not placed on the board
R2B-C  not placed on the board
R3-2C  not placed on the board
R3-C  not placed on the board
R3-J1C  not placed on the board
R3-J2C  not placed on the board
R3-LS1C  not placed on the board
R4-2C  not placed on the board
R4-C  not placed on the board
R4-J1C  not placed on the board
R5-C  not placed on the board
R6-C  not placed on the board
S0-0C  not placed on the board
S1-0C  not placed on the board
U0-C  83.82,53.34 0 top
U1-C  not placed on the board
U2-C  not placed on the board
VR1-LS1C  not placed on the board
Y1-C  not placed on the board

### Tracks (layer width: path | path; a pad name or v marks a point on that pad's centre or on a via)
3V3  (40 unrouted)
5V  (2 unrouted)
ACCEL_ANALOG  (1 unrouted)
ADC-ERROR  (1 unrouted)
ADC_ALERT  (2 unrouted)
ADDR  (1 unrouted)
ARMED-LED  (3 unrouted)
BATT_MEAS  (1 unrouted)
BOOT0  (1 unrouted)
BUZZER_OUT  (1 unrouted)
CENTRAL-ERROR  (2 unrouted)
CENTRAL-NOMINAL  (2 unrouted)
CLK-1  (1 unrouted)
CLK-3  (1 unrouted)
CS1  (1 unrouted)
CS2  (1 unrouted)
CS-3  (1 unrouted)
CTS  (1 unrouted)
D0A-C_R0A-C  (1 unrouted)
D0B-C_R0B-C  (1 unrouted)
D0C-C_R0C-C  (1 unrouted)
D1A-C_R1A-C  (1 unrouted)
D1B-C_R1B-C  (1 unrouted)
D2A-C_R2A-C  (1 unrouted)
D2B-C_R2B-C  (1 unrouted)
D3-C_R3-C  (1 unrouted)
D4-C_R4-C  (1 unrouted)
D5-C_R5-C  (1 unrouted)
D6-C_R6-C  (1 unrouted)
D+  (2 unrouted)
D+_R2-J1C  (1 unrouted)
D-  (1 unrouted)
D-_R1-J1C  (1 unrouted)
DISARM_INPUT  (2 unrouted)
DROGUE-LED  (1 unrouted)
FIRE_A  (1 unrouted)
FIRE_B  (1 unrouted)
FIRE_C  (1 unrouted)
FIRE_D  (1 unrouted)
GND  (58 unrouted)
HOLD  (1 unrouted)
ID  (1 unrouted)
J1-C_R1-J1C  (1 unrouted)
J1-C_R2-J1C  (1 unrouted)
MAIN-LED  (1 unrouted)
MASTER_RX-1  (1 unrouted)
MASTER_RX-2  (1 unrouted)
MASTER_TX-1  (1 unrouted)
MASTER_TX-2  (1 unrouted)
MISO-1  (1 unrouted)
MISO-3  (1 unrouted)
MOSI-1  (1 unrouted)
MOSI-3  (1 unrouted)
N$1  (via drill 3 pad 4)
  other vias: 5.08,5.08
N$3  (via drill 3 pad 4)
  other vias: 5.08,96.52
N$4  (via drill 3 pad 4)
  other vias: 147.32,96.52
N$5  (via drill 3 pad 4)
  other vias: 147.32,5.08
NRST  (4 unrouted)
OSC_IN  (2 unrouted)
OSC_OUT  (2 unrouted)
Q1-LS1C_R2-LS1C  (1 unrouted)
R1-LS1C_Q1-LS1C  (1 unrouted)
R2-LS1C_LS1-C  (1 unrouted)
RTS  (1 unrouted)
SCL-1  (2 unrouted)
SDA-1  (2 unrouted)
SENSE_A  (2 unrouted)
SENSE_B  (2 unrouted)
SENSE_C  (2 unrouted)
SENSE_D  (2 unrouted)
STORAGE-ERROR  (1 unrouted)
SWCLK  (3 unrouted)
SWDIO  (3 unrouted)
SWO  (1 unrouted)
U1S-CHECK  (1 unrouted)
U2S-CHECK  (1 unrouted)
U2S-ST  (1 unrouted)
U3S-CHECK  (1 unrouted)
U4S-CHECK  (1 unrouted)
US2-STATUS  (1 unrouted)
VCAP_1  (1 unrouted)
VCAP_2  (1 unrouted)
VDDA  (2 unrouted)
VR1-LS1C  (1 unrouted)
VR1-LS1C_R3-LS1C  (1 unrouted)
VUSB  (1 unrouted)
WP  (1 unrouted)